# Altium project DVT-LPF.PrjPcb
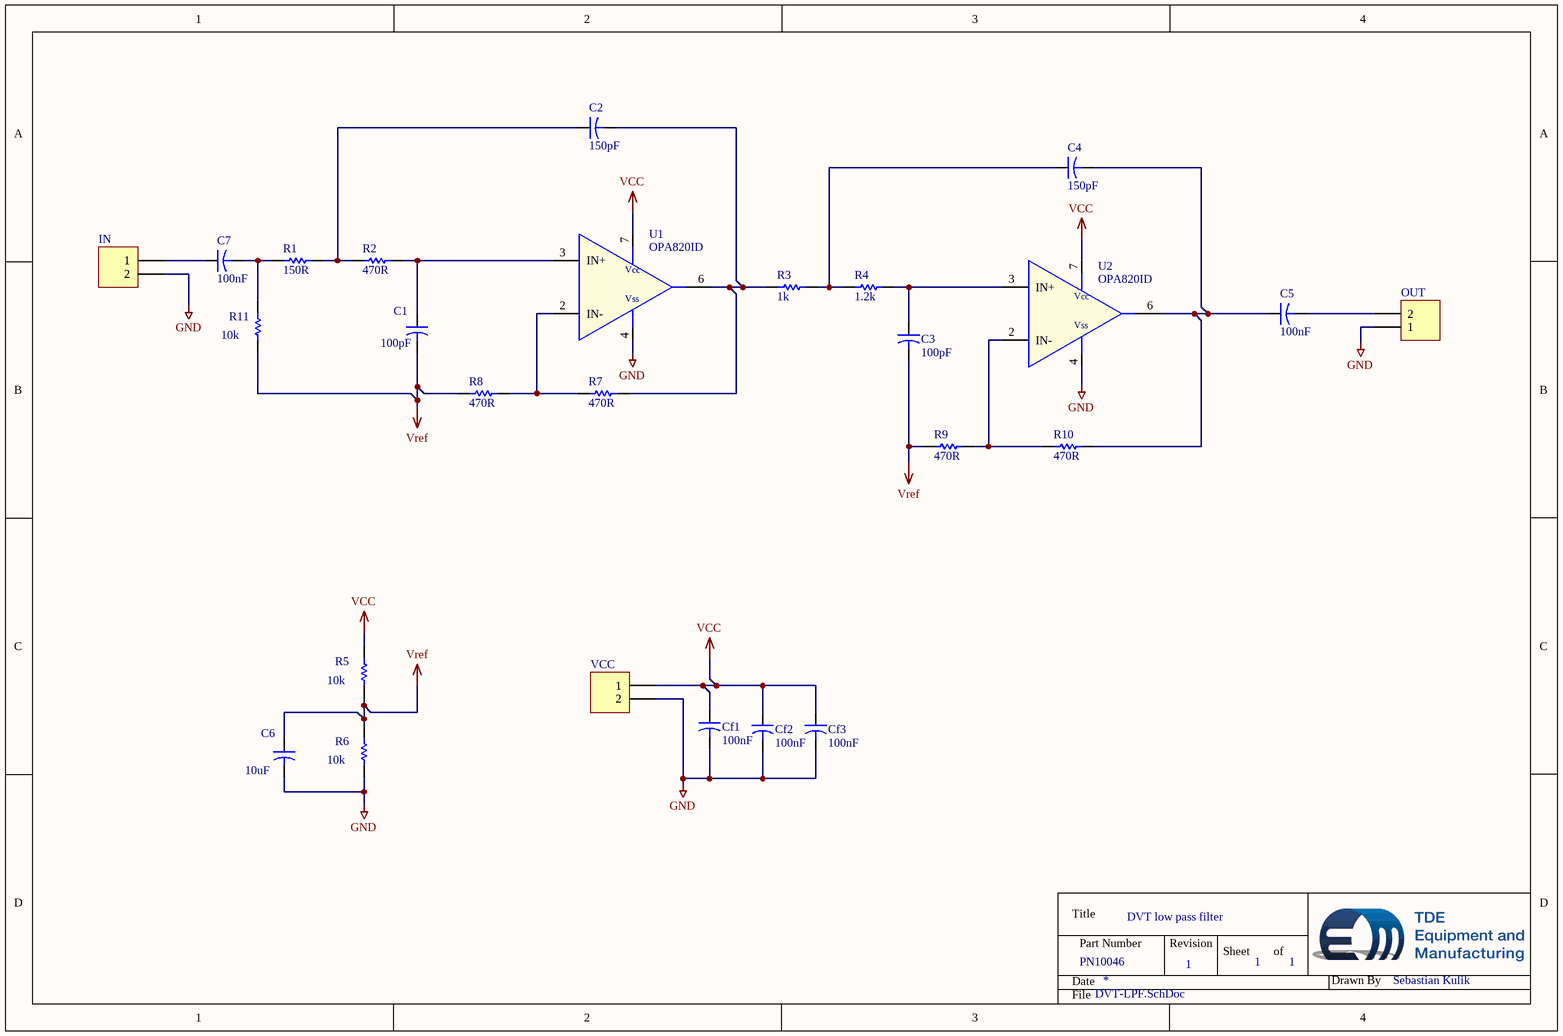
[diagram p0: DVT-LPF.SchDoc]
1 sheet, 28 parts. Net scope: global (net labels, ports and power ports of the same name join across sheets).
Board file: DVT-LPF.PcbDoc

## Sheet DVT-LPF.SchDoc: DVT low pass filter
size A4; Revision: 1; SheetNumber: 1; SheetTotal: 1; PartNumber: PN10046; Drawn By: Sebastian Kulik; ProjectName: DVT Low Pass Filter

### Parts
*  Om  [Om-5mm]  (value not drawn)
-  Om  [Om-5mm]  (value not drawn)
C1  value 100pF  [Dummy-10mm]  (hidden comment: Capacitor-Dummy-THT)
C2  value 150pF  [Dummy-10mm]  (hidden comment: Capacitor-Dummy-THT)
C3  value 100pF  [Dummy-10mm]  (hidden comment: Capacitor-Dummy-THT)
C4  value 150pF  [Dummy-10mm]  (hidden comment: Capacitor-Dummy-THT)
C5  value 100nF  [Dummy-10mm]  (hidden comment: Capacitor-Dummy-THT)
C6  value 10uF  [Dummy-10mm]  (hidden comment: Capacitor-Dummy-THT)
C7  value 100nF  [Dummy-10mm]  (hidden comment: Capacitor-Dummy-THT)
Cf1  value 100nF  [Dummy-10mm]  (hidden comment: Capacitor-Dummy-THT)
Cf2  value 100nF  [Dummy-10mm]  (hidden comment: Capacitor-Dummy-THT)
Cf3  value 100nF  [Dummy-10mm]  (hidden comment: Capacitor-Dummy-THT)
IN  PHOENIX_1715721  [Phoenix-2-5_08]  (value not drawn)
OUT  PHOENIX_1715721  [Phoenix-2-5_08]  (value not drawn)
R1  value 150R  [Dummy-10mm]  (hidden comment: Resistor-Dummy-THT)
R2  value 470R  [Dummy-10mm]  (hidden comment: Resistor-Dummy-THT)
R3  value 1k  [Dummy-10mm]  (hidden comment: Resistor-Dummy-THT)
R4  value 1.2k  [Dummy-10mm]  (hidden comment: Resistor-Dummy-THT)
R5  value 10k  [Dummy-10mm]  (hidden comment: Resistor-Dummy-THT)
R6  value 10k  [Dummy-10mm]  (hidden comment: Resistor-Dummy-THT)
R7  value 470R  [Dummy-10mm]  (hidden comment: Resistor-Dummy-THT)
R8  value 470R  [Dummy-10mm]  (hidden comment: Resistor-Dummy-THT)
R9  value 470R  [Dummy-10mm]  (hidden comment: Resistor-Dummy-THT)
R10  value 470R  [Dummy-10mm]  (hidden comment: Resistor-Dummy-THT)
R11  value 10k  [Dummy-10mm]  (hidden comment: Resistor-Dummy-THT)
U1  OPA820ID  [SOP8_L]
U2  OPA820ID  [SOP8_L]
VCC  PHOENIX_1715721  [Phoenix-2-5_08]  (value not drawn)

### Nets
GND: C6.2 Cf1.2 Cf2.2 Cf3.2 IN.2 OUT.1 R6.1 U1.4(Vss) U2.4(Vss) VCC.2
VCC: Cf1.1 Cf2.1 Cf3.1 R5.2 U1.7(Vcc) U2.7(Vcc) VCC.1
Vref: C1.2 C3.2 C6.1 R5.1 R6.2 R8.2 R9.2 R11.1
NetC1_1: C1.1 R2.1 U1.3(IN+)
NetC2_1: C2.1 R1.1 R2.2
NetC2_2: C2.2 R3.2 R7.1 U1.6(OUT)
NetC3_1: C3.1 R4.1 U2.3(IN+)
NetC4_1: C4.1 R3.1 R4.2
NetC4_2: C4.2 C5.1 R10.1 U2.6(OUT)
NetC5_2: C5.2 OUT.2
NetC7_1: C7.1 IN.1
NetC7_2: C7.2 R1.2 R11.2
NetR7_2: R7.2 R8.1 U1.2(IN-)
NetR9_1: R9.1 R10.2 U2.2(IN-)

### Notes on the sheet
- Title
- Date
- Part Number
- Revision
- Sheet
- of
- Drawn By
- File

### Library data of the parts
C1 C3 = Capacitor-Dummy-THT: Deliverer PartNr: 537-3549; Deliverer: RS; Published: 08.12.2015; Part Description: Capacitor-Dummy-THT; Publisher: Sebastian Kulik; PackageDescription: -; Manufacturer: -; Manufacturer PartNr: -; TDE-PN: -; Price: 0.224/25
C2 C4 = Capacitor-Dummy-THT: Deliverer PartNr: 699-5030; Deliverer: RS; Published: 08.12.2015; Part Description: Capacitor-Dummy-THT; Publisher: Sebastian Kulik; PackageDescription: -; Manufacturer: -; Manufacturer PartNr: -; TDE-PN: -; Price: 0.305/25
C5 C7 = Capacitor-Dummy-THT: Deliverer PartNr: 538-1310; Deliverer: RS; Published: 08.12.2015; Part Description: Capacitor-Dummy-THT; Publisher: Sebastian Kulik; PackageDescription: -; Manufacturer: -; Manufacturer PartNr: -; TDE-PN: -; Price: 0.116/5
C6 = Capacitor-Dummy-THT: Deliverer PartNr: 117-035; Deliverer: RS; Published: 08.12.2015; Part Description: Capacitor-Dummy-THT; Publisher: Sebastian Kulik; PackageDescription: -; Manufacturer: -; Manufacturer PartNr: -; TDE-PN: -; Price: 0.144/5
Cf1-Cf3 = Capacitor-Dummy-THT: Deliverer PartNr: 537-3707; Deliverer: RS; Published: 08.12.2015; Part Description: Capacitor-Dummy-THT; Publisher: Sebastian Kulik; PackageDescription: -; Manufacturer: -; Manufacturer PartNr: -; TDE-PN: -; Price: 0.156/25
IN OUT VCC = 2Pol_1715721: Phoenix, 2 pol, 5.08mm, 22A, 715721; Deliverer PartNr: 193-0564; Deliverer: RS; TDE-PN: CON0008; LatestRevisionDate: 02.05.2014; LatestRevisionNote: Re-released for DXP Platform.; Publisher: Sebastian Kulik; Manufacturer PartNr: 1715721; Manufacturer: Phoenix; PackageDescription: Phoenix-2-5_08
  IN OUT: Price: 0.976/5
R1 = Resistor-Dummy-THT: Deliverer PartNr: 132-292; Deliverer: RS; Published: 08.12.2015; Publisher: Sebastian Kulik; PackageDescription: -; Manufacturer: -; Manufacturer PartNr: -; TDE-PN: -; Part Desicription: Resistor-Dummy-THT; Price: 0.161/10
R2 R7-R10 = Resistor-Dummy-THT: Deliverer PartNr: 148-427; Deliverer: RS; Published: 08.12.2015; Publisher: Sebastian Kulik; PackageDescription: -; Manufacturer: -; Manufacturer PartNr: -; TDE-PN: -; Part Desicription: Resistor-Dummy-THT; Price: 0.043/10
R3 = Resistor-Dummy-THT: Deliverer PartNr: 148-506; Deliverer: RS; Published: 08.12.2015; Publisher: Sebastian Kulik; PackageDescription: -; Manufacturer: -; Manufacturer PartNr: -; TDE-PN: -; Part Desicription: Resistor-Dummy-THT; Price: 0.027/10
R4 = Resistor-Dummy-THT: Deliverer PartNr: 148-528; Deliverer: RS; Published: 08.12.2015; Publisher: Sebastian Kulik; PackageDescription: -; Manufacturer: -; Manufacturer PartNr: -; TDE-PN: -; Part Desicription: Resistor-Dummy-THT; Price: 0.035/10
R5 R6 R11 = Resistor-Dummy-THT: Deliverer PartNr: 148-736; Deliverer: RS; Published: 08.12.2015; Publisher: Sebastian Kulik; PackageDescription: -; Manufacturer: -; Manufacturer PartNr: -; TDE-PN: -; Part Desicription: Resistor-Dummy-THT; Price: 0.027/10
U1 U2 = OPA820ID: High speed OP, 260MHz; Deliverer PartNr: 661-1053; Manufacturer: TI; Deliverer: RS; TDE-PN: IC00077; Published: 31.05.2016; PackageDescription: TSSOP8; Publisher: Sebastian Kulik; Manufacturer PartNr: OPA820ID; Price: 2.548/5